# Altium schematic sheet Sheet1.SchDoc
size A4; SheetNumber: 1; SheetTotal: 1
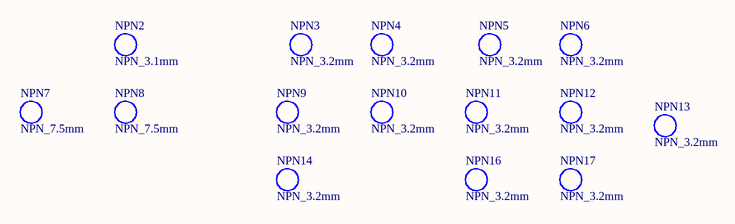
[diagram p0: Sheet1.SchDoc]

## Parts
NPN2  NPN_3.1mm  [HOLE_NPH_3.1_LED_3mm]
NPN3  NPN_3.2mm  [HOLE_NPH_3.2_M3]
NPN4  NPN_3.2mm  [HOLE_NPH_3.2_M3]
NPN5  NPN_3.2mm  [HOLE_NPH_3.2_M3]
NPN6  NPN_3.2mm  [HOLE_NPH_3.2_M3]
NPN7  NPN_7.5mm  [HOLE_NPH_7.5_F01]
NPN8  NPN_7.5mm  [HOLE_NPH_7.5_F01]
NPN9  NPN_3.2mm  [HOLE_NPH_3.2_M3]
NPN10  NPN_3.2mm  [HOLE_NPH_3.2_M3]
NPN11  NPN_3.2mm  [HOLE_NPH_3.2_M3]
NPN12  NPN_3.2mm  [HOLE_NPH_3.2_M3]
NPN13  NPN_3.2mm  [HOLE_NPH_3.2_M3]
NPN14  NPN_3.2mm  [HOLE_NPH_3.2_M3]
NPN16  NPN_3.2mm  [HOLE_NPH_3.2_M3]
NPN17  NPN_3.2mm  [HOLE_NPH_3.2_M3]

## Library data of the parts
NPN2 = NPH_3.1mm_LED_3mm
NPN3-NPN6 NPN9-NPN14 NPN16 NPN17 = NPH_3.2mm_M3
NPN7 NPN8 = NPH_7.5mm_F01